# Altium schematic sheet TopLevel.SchDoc
size A; SheetNumber: 1; SheetTotal: 5
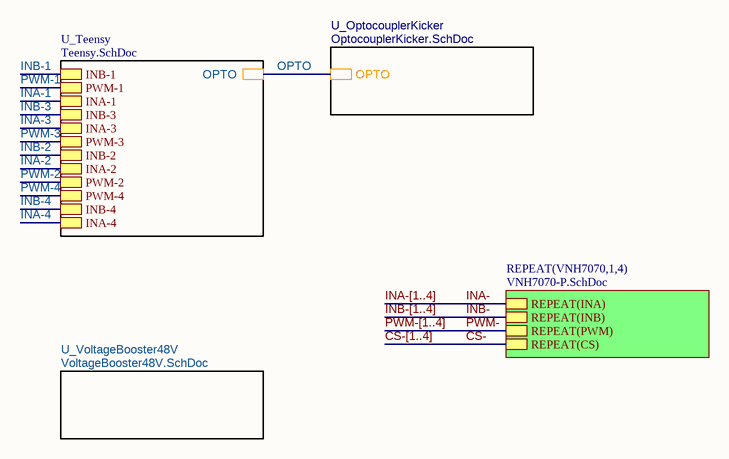
[diagram p0: TopLevel.SchDoc]

## Sub-sheets
REPEAT(VNH7070,1,4) = VNH7070-P.SchDoc: REPEAT(INA), REPEAT(INB), REPEAT(PWM), REPEAT(CS)
U_OptocouplerKicker = OptocouplerKicker.SchDoc: OPTO
U_Teensy = Teensy.SchDoc: OPTO, INB-1, PWM-1, INA-1, INB-3, INA-3, PWM-3, INB-2, INA-2, PWM-2, PWM-4, INB-4, INA-4
U_VoltageBooster48V = VoltageBooster48V.SchDoc: no entries

## Nets
CS-: sheet REPEAT(VNH7070,1,4)/REPEAT(CS)
INA-: sheet REPEAT(VNH7070,1,4)/REPEAT(INA)
INA-1: sheet U_Teensy/INA-1
INA-2: sheet U_Teensy/INA-2
INA-3: sheet U_Teensy/INA-3
INA-4: sheet U_Teensy/INA-4
INB-: sheet REPEAT(VNH7070,1,4)/REPEAT(INB)
INB-1: sheet U_Teensy/INB-1
INB-2: sheet U_Teensy/INB-2
INB-3: sheet U_Teensy/INB-3
INB-4: sheet U_Teensy/INB-4
OPTO: sheet U_Teensy/OPTO, sheet U_OptocouplerKicker/OPTO
PWM-: sheet REPEAT(VNH7070,1,4)/REPEAT(PWM)
PWM-1: sheet U_Teensy/PWM-1
PWM-2: sheet U_Teensy/PWM-2
PWM-3: sheet U_Teensy/PWM-3
PWM-4: sheet U_Teensy/PWM-4

## Buses and harness runs
bus CS-[1..4]
bus INA-[1..4]
bus INB-[1..4]
bus PWM-[1..4]